# Altium schematic sheet Stend.SchDoc: Перестраиваемый генератор
size 420 x 297 mm; CheckedBy: Семенцов С. Г.; Author: Наумов И. К.; Address1: Address1; Address2: Address2; Address3: Address3; Address4: Address4; DocumentNumber: ИУ4.11.03.03.24.05.52.15.003 Э1; SheetNumber: 3; SheetTotal: 4; Title2str: прямоугольных импульсов; DocumentType: Структурная схема измерительного стенда; FirstReferrence: ИУ4.11.03.03.24.05.52.15.001
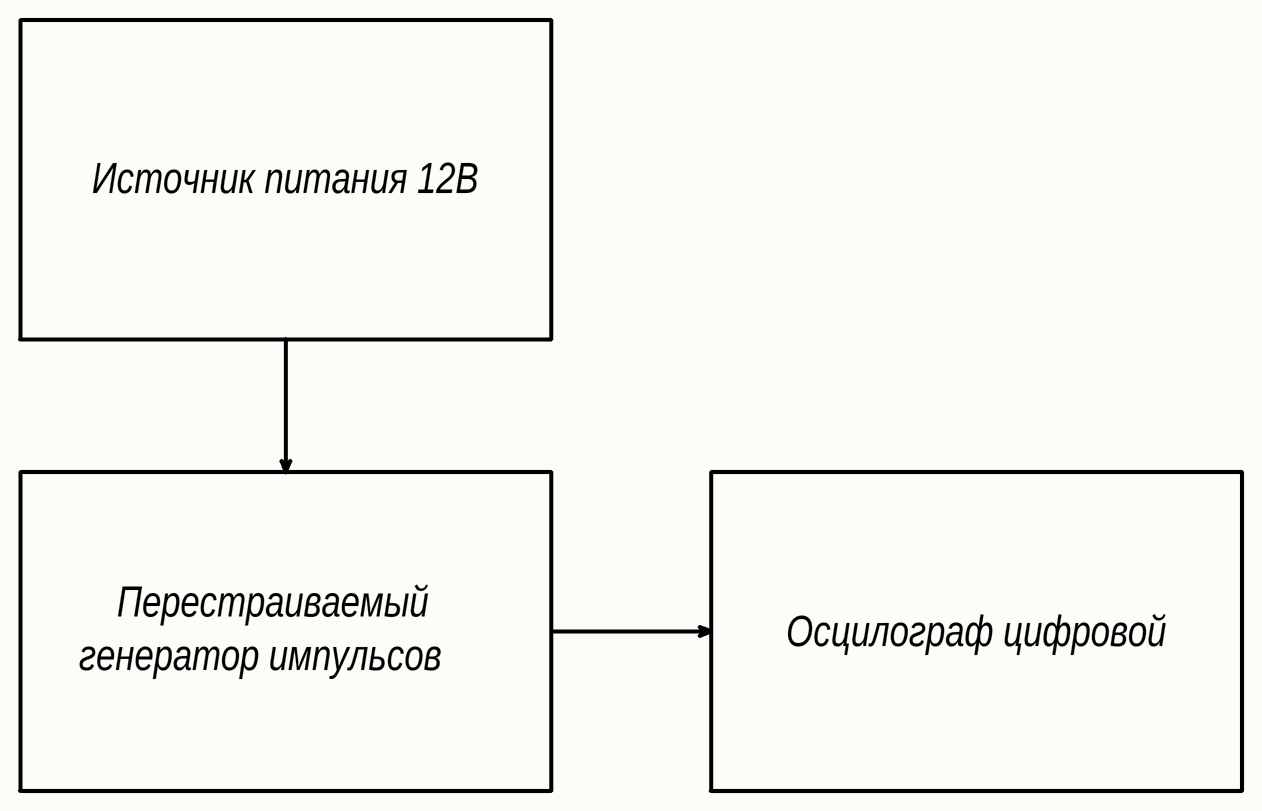
[diagram p0: Stend.SchDoc]

## Notes on the sheet
- Источник питания 12В
- Перестраиваемый
- Осцилограф цифровой
- генератор импульсов
- Перв. примен.
- Справ. №
- Подп. и дата
- Инв. № дубл.
- Взам. инв. №
- Разраб.
- Изм.
- Лист
- № докум.
- Подп.
- Дата
- Лит.
- Масса
- Масштаб
- Пров.
- Т.контр.
- Листов
- 1
- Инв. № подл.
- Утв.
- Н.контр.
- Кафедра ИУ4
- МГТУ им. Н. Э. Баумана
- 2.106-A3
- Копировал
- Формат А3
- Группа ИУ4-52Б